# Altium schematic sheet 30_SOC.SchDoc
size A3; SheetNumber: 4; SheetTotal: 12
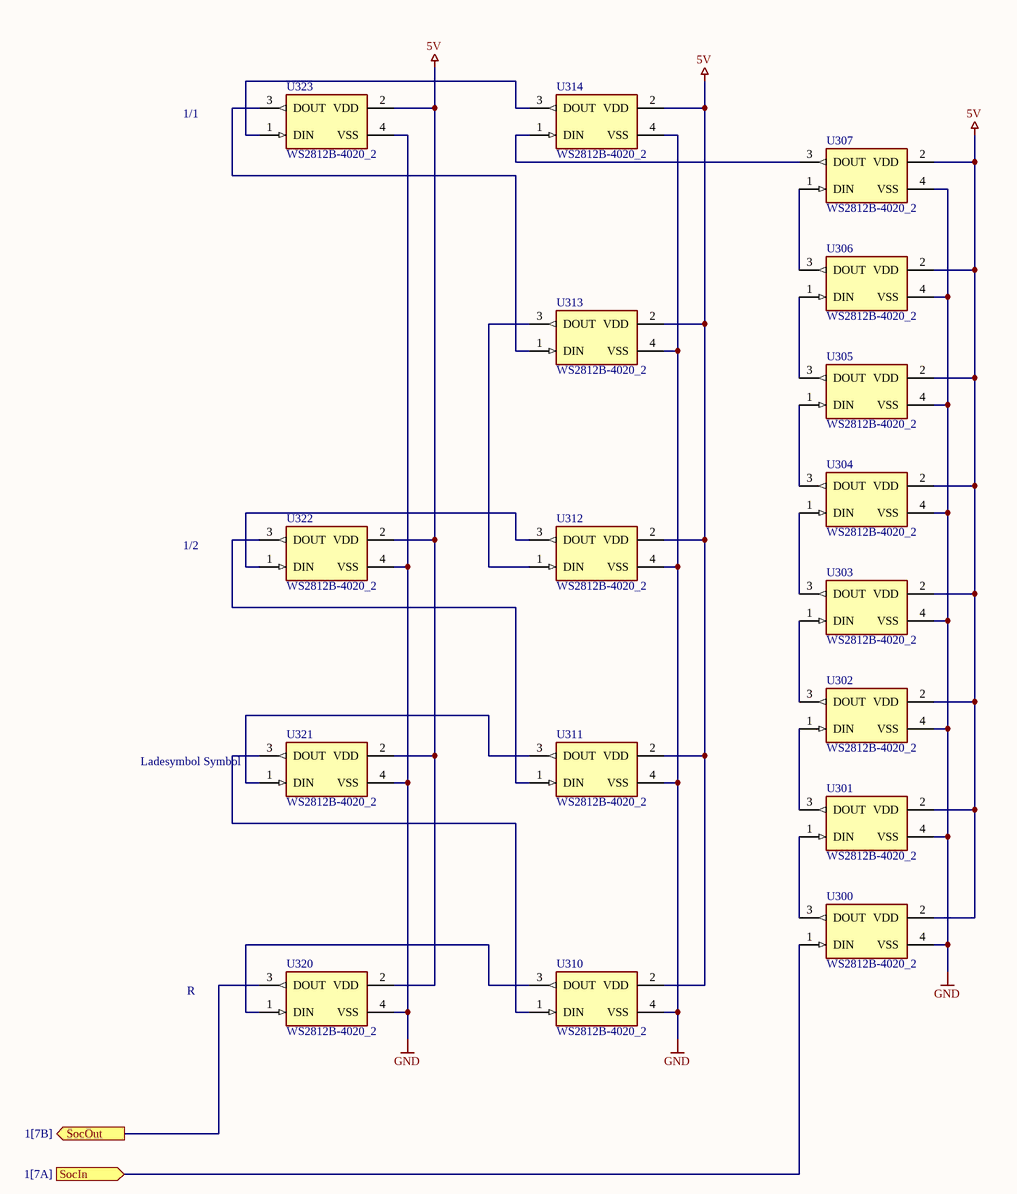
[diagram p0: 30_SOC.SchDoc]

## Parts
U300  WS2812B-4020_2  [LED_WS2812B-4020]
U301  WS2812B-4020_2  [LED_WS2812B-4020]
U302  WS2812B-4020_2  [LED_WS2812B-4020]
U303  WS2812B-4020_2  [LED_WS2812B-4020]
U304  WS2812B-4020_2  [LED_WS2812B-4020]
U305  WS2812B-4020_2  [LED_WS2812B-4020]
U306  WS2812B-4020_2  [LED_WS2812B-4020]
U307  WS2812B-4020_2  [LED_WS2812B-4020]
U310  WS2812B-4020_2  [LED_WS2812B-4020]
U311  WS2812B-4020_2  [LED_WS2812B-4020]
U312  WS2812B-4020_2  [LED_WS2812B-4020]
U313  WS2812B-4020_2  [LED_WS2812B-4020]
U314  WS2812B-4020_2  [LED_WS2812B-4020]
U320  WS2812B-4020_2  [LED_WS2812B-4020]
U321  WS2812B-4020_2  [LED_WS2812B-4020]
U322  WS2812B-4020_2  [LED_WS2812B-4020]
U323  WS2812B-4020_2  [LED_WS2812B-4020]

## Ports
SocIn (in, see 1[7A]), SocOut (out, see 1[7B])

## Nets
5V: U300.2(VDD) U301.2(VDD) U302.2(VDD) U303.2(VDD) U304.2(VDD) U305.2(VDD) U306.2(VDD) U307.2(VDD) U310.2(VDD) U311.2(VDD) U312.2(VDD) U313.2(VDD) U314.2(VDD) U320.2(VDD) U321.2(VDD) U322.2(VDD) U323.2(VDD)
GND: U300.4(VSS) U301.4(VSS) U302.4(VSS) U303.4(VSS) U304.4(VSS) U305.4(VSS) U306.4(VSS) U307.4(VSS) U310.4(VSS) U311.4(VSS) U312.4(VSS) U313.4(VSS) U314.4(VSS) U320.4(VSS) U321.4(VSS) U322.4(VSS) U323.4(VSS)
SocIn: U300.1(DIN) ; port SocIn
SocOut: U320.3(DOUT) ; port SocOut
NetU300_3: U300.3(DOUT) U301.1(DIN)
NetU301_3: U301.3(DOUT) U302.1(DIN)
NetU302_3: U302.3(DOUT) U303.1(DIN)
NetU303_3: U303.3(DOUT) U304.1(DIN)
NetU304_3: U304.3(DOUT) U305.1(DIN)
NetU305_3: U305.3(DOUT) U306.1(DIN)
NetU306_3: U306.3(DOUT) U307.1(DIN)
NetU307_3: U307.3(DOUT) U314.1(DIN)
NetU310_1: U310.1(DIN) U321.3(DOUT)
NetU310_3: U310.3(DOUT) U320.1(DIN)
NetU311_1: U311.1(DIN) U322.3(DOUT)
NetU311_3: U311.3(DOUT) U321.1(DIN)
NetU312_1: U312.1(DIN) U313.3(DOUT)
NetU312_3: U312.3(DOUT) U322.1(DIN)
NetU313_1: U313.1(DIN) U323.3(DOUT)
NetU314_3: U314.3(DOUT) U323.1(DIN)

## Notes on the sheet
- 1/1
- 1/2
- (near U321) Ladesymbol Symbol
- R

## Library data of the parts
U300-U307 U310-U314 U320-U323 = WS2812B-4020_2: 12mA RGB SMD,2x4mm Light Emitting Diodes; MF: Worldsemi; Price: None; MP: WS2812B-4020; Availability: Not in stock; SnapEDA_Link: https://www.snapeda.com/parts/WS2812B-4020/Worldsemi/view-part/?ref=snap; Check_prices: https://www.snapeda.com/parts/WS2812B-4020/Worldsemi/view-part/?ref=eda; Value: *; Package: Package